# EAGLE design pov (EAGLE 6.2)
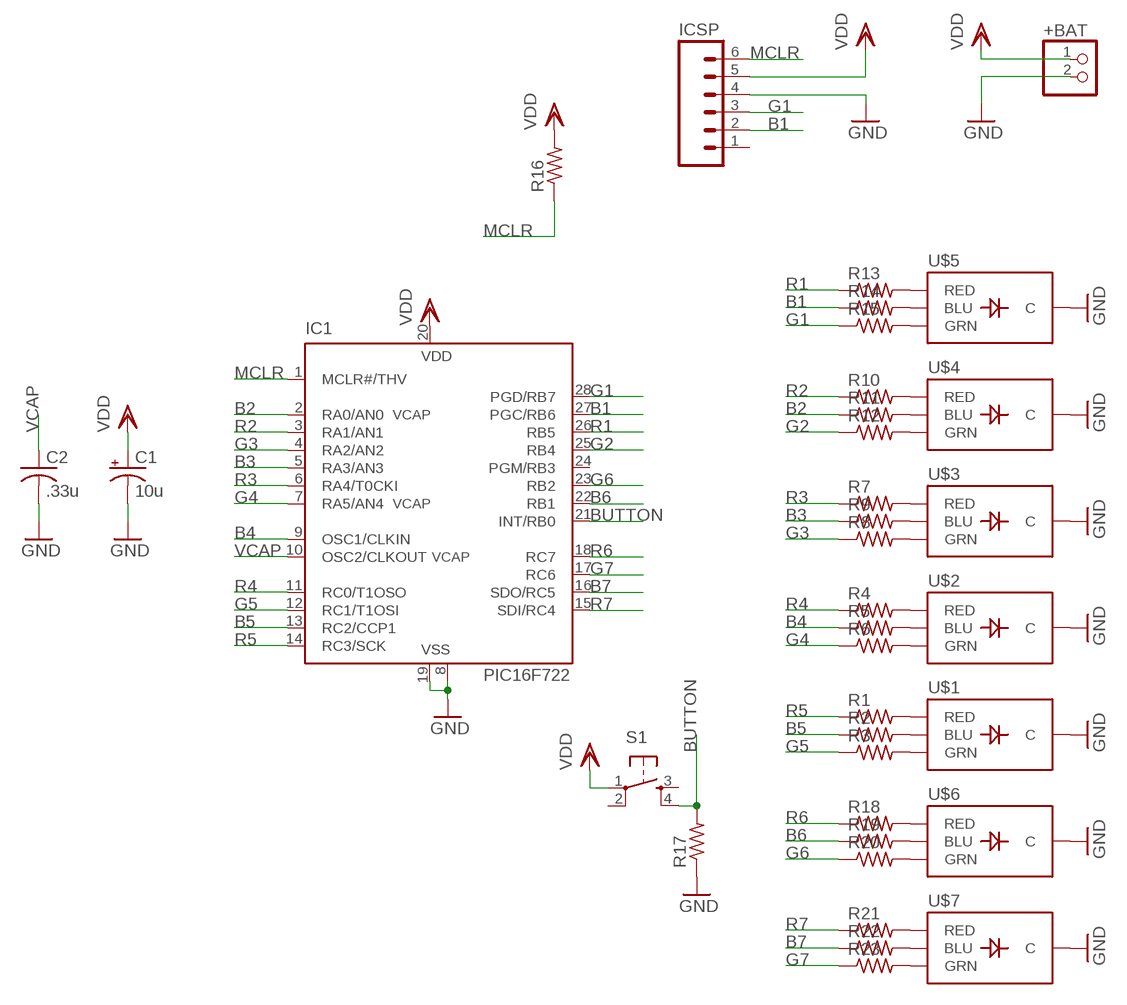
[diagram p0: schematic, sheet 1]

## Parts
+BAT  PINHD-1X2  [1X02]
C1  10u  CAP_POLPTH2  [CPOL-RADIAL-10UF-25V]
C2  .33u  C-US050-024X044  [C050-024X044]
IC1  PIC16F722  PIC16F872P  [DIL28-3]
ICSP  M06LOCK  [1X06_LOCK]
R1  R-US_0207/10  [0207/10]
R2  R-US_0207/10  [0207/10]
R3  R-US_0207/10  [0207/10]
R4  R-US_0207/10  [0207/10]
R5  R-US_0207/10  [0207/10]
R6  R-US_0207/10  [0207/10]
R7  R-US_0207/10  [0207/10]
R8  R-US_0207/10  [0207/10]
R9  R-US_0207/10  [0207/10]
R10  R-US_0207/10  [0207/10]
R11  R-US_0207/10  [0207/10]
R12  R-US_0207/10  [0207/10]
R13  R-US_0207/10  [0207/10]
R14  R-US_0207/10  [0207/10]
R15  R-US_0207/10  [0207/10]
R16  R-US_0207/10  [0207/10]
R17  R-US_0207/10  [0207/10]
R18  R-US_0207/10  [0207/10]
R19  R-US_0207/10  [0207/10]
R20  R-US_0207/10  [0207/10]
R21  R-US_0207/10  [0207/10]
R22  R-US_0207/10  [0207/10]
R23  R-US_0207/10  [0207/10]
S1  TAC_SWITCHPTH  [TACTILE-PTH]
U$1  LED-TRICOLOR-THROUGHHOLE  [LED-TRICOLOR-THROUGHHOLE]
U$2  LED-TRICOLOR-THROUGHHOLE  [LED-TRICOLOR-THROUGHHOLE]
U$3  LED-TRICOLOR-THROUGHHOLE  [LED-TRICOLOR-THROUGHHOLE]
U$4  LED-TRICOLOR-THROUGHHOLE  [LED-TRICOLOR-THROUGHHOLE]
U$5  LED-TRICOLOR-THROUGHHOLE  [LED-TRICOLOR-THROUGHHOLE]
U$6  LED-TRICOLOR-THROUGHHOLE  [LED-TRICOLOR-THROUGHHOLE]
U$7  LED-TRICOLOR-THROUGHHOLE  [LED-TRICOLOR-THROUGHHOLE]

## Nets
B1: IC1.27(PGC/RB6) ICSP.2 R14.1
B2: IC1.2(RA0/AN0) R11.1
B3: IC1.5(RA3/AN3) R9.1
B4: IC1.9(OSC1/CLKIN) R5.1
B5: IC1.13(RC2/CCP1) R2.1
B6: IC1.22(RB1) R19.1
B7: IC1.16(SDO/RC5) R22.1
BUTTON: IC1.21(INT/RB0) R17.2 S1.4
G1: IC1.28(PGD/RB7) ICSP.3 R15.1
G2: IC1.25(RB4) R12.1
G3: IC1.4(RA2/AN2) R8.1
G4: IC1.7(RA5/AN4) R6.1
G5: IC1.12(RC1/T1OSI) R3.1
G6: IC1.23(RB2) R20.1
G7: IC1.17(RC6) R23.1
GND: +BAT.2 C1.2(-) C2.2 IC1.8(VSS) IC1.19(VSS) ICSP.4 R17.1 U$1.GND(C) U$2.GND(C) U$3.GND(C) U$4.GND(C) U$5.GND(C) U$6.GND(C) U$7.GND(C)
MCLR: IC1.1(MCLR#/THV) ICSP.6 R16.1
N$1: R1.2 U$1.RED
N$2: R2.2 U$1.BLU
N$3: R3.2 U$1.GRN
N$4: R4.2 U$2.RED
N$5: R5.2 U$2.BLU
N$6: R6.2 U$2.GRN
N$7: R7.2 U$3.RED
N$8: R9.2 U$3.BLU
N$9: R10.2 U$4.RED
N$10: R11.2 U$4.BLU
N$11: R12.2 U$4.GRN
N$12: R13.2 U$5.RED
N$13: R14.2 U$5.BLU
N$14: R15.2 U$5.GRN
N$15: R8.2 U$3.GRN
N$17: R18.2 U$6.RED
N$18: R19.2 U$6.BLU
N$19: R20.2 U$6.GRN
N$20: R21.2 U$7.RED
N$21: R22.2 U$7.BLU
N$22: R23.2 U$7.GRN
R1: IC1.26(RB5) R13.1
R2: IC1.3(RA1/AN1) R10.1
R3: IC1.6(RA4/T0CKI) R7.1
R4: IC1.11(RC0/T1OSO) R4.1
R5: IC1.14(RC3/SCK) R1.1
R6: IC1.18(RC7) R18.1
R7: IC1.15(SDI/RC4) R21.1
VCAP: C2.1 IC1.10(OSC2/CLKOUT)
VDD: +BAT.1 C1.1(+) IC1.20(VDD) ICSP.5 R16.2 S1.1
Unconnected: IC1.24(PGM/RB3) ICSP.1 S1.2 S1.3

## Notes on the sheet
- VCAP
- VCAP
- VCAP

## Library data of the parts
+BAT = pinhead:PINHD-1X2: PIN HEADER
C1 = SparkFun:CAP_POL: Capacitor Polarized These are standard SMD and PTH capacitors. Normally 10uF, 47uF, and 100uF in electrolytic and tantalum varieties. Always verify the external diameter of the through hole cap, it varies with capacity, voltage, and manufacturer. The EIA devices should be standard.
C2 = rcl:C-US: CAPACITOR, American symbol
IC1 = microchip-5:PIC16*872: MICROCONTROLLER flash type
ICSP = SparkFun:M06: Header 6 Standard 6-pin 0.1" header. Use with straight break away headers (SKU : PRT-00116), right angle break away headers (PRT-00553), swiss pins (PRT-00743), machine pins (PRT-00117), and female headers (PRT-00115). Molex polarized connector foot print use with SKU : PRT-08094 with associated crimp pins and housings. NOTES ON THE VARIANTS LOCK and LOCK_LONGPADS... This footprint was designed to help hold the alignment of a through-hole component (i.e. 6-pin header) while soldering it into place. You may notice that each hole has been shifted either up or down by 0.005 of an inch from it's more standard position (which is a perfectly straight line). This slight alteration caused the pins (the squares in the middle) to touch the edges of the holes. Because they are alternating, it causes a "brace" to hold the component in place. 0.005 has proven to be the perfect amount of "off-center" position when using our standard breakaway headers. Although looks a little odd when you look at the bare footprint, once you have a header in there, the alteration is very hard to notice. Also, if you push a header all the way into place, it is covered up entirely on the bottom side. This idea of altering the position of holes to aid alignment will be further integrated into the Sparkfun Library for other footprints. It can help hold any component with 3 or more connection pins.
R1-R23 = rcl:R-US_: RESISTOR, American symbol
S1 = SparkFun:TAC_SWITCH: Momentary Switch Button commonly used for reset or general input. Spark Fun Electronics SKU : COM-00097
U$1-U$7 = SparkFun:LED-TRICOLOR-THROUGHHOLE

## Board
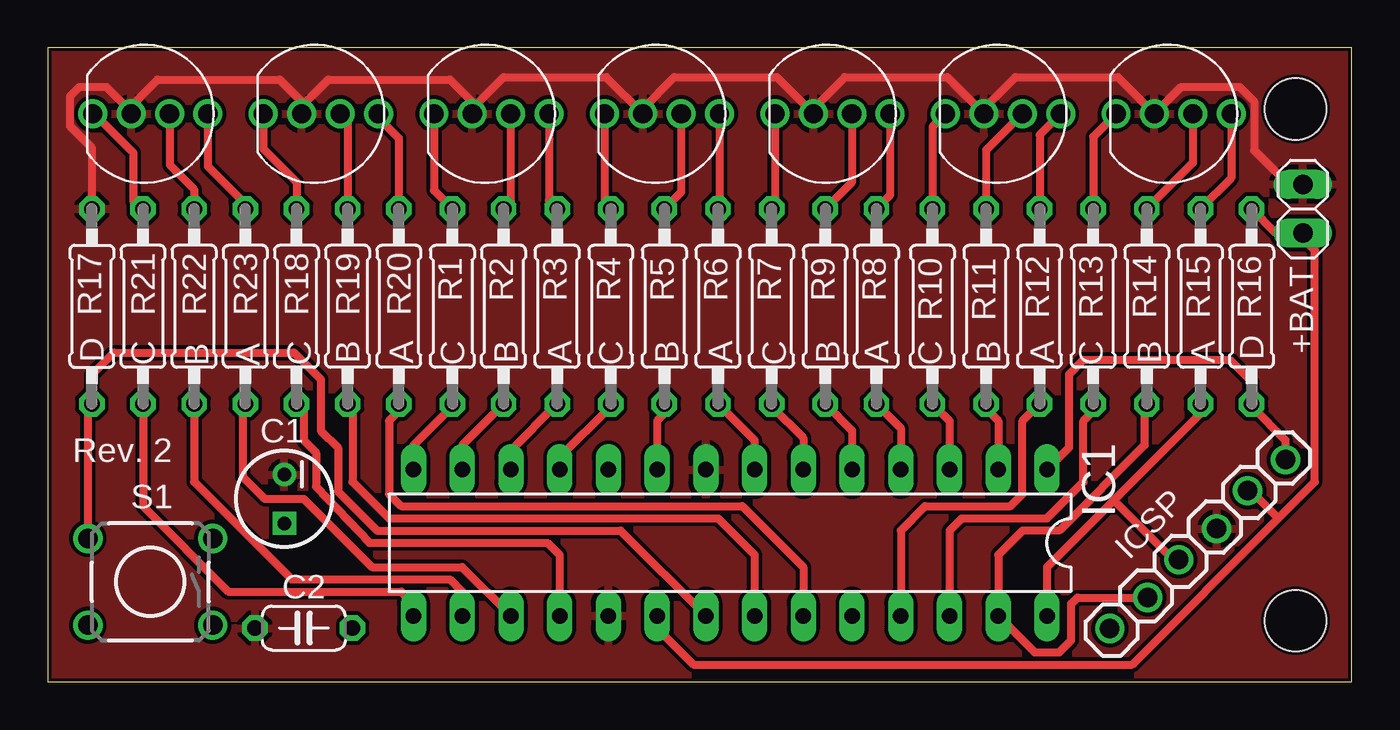
[diagram p1: board, top side]
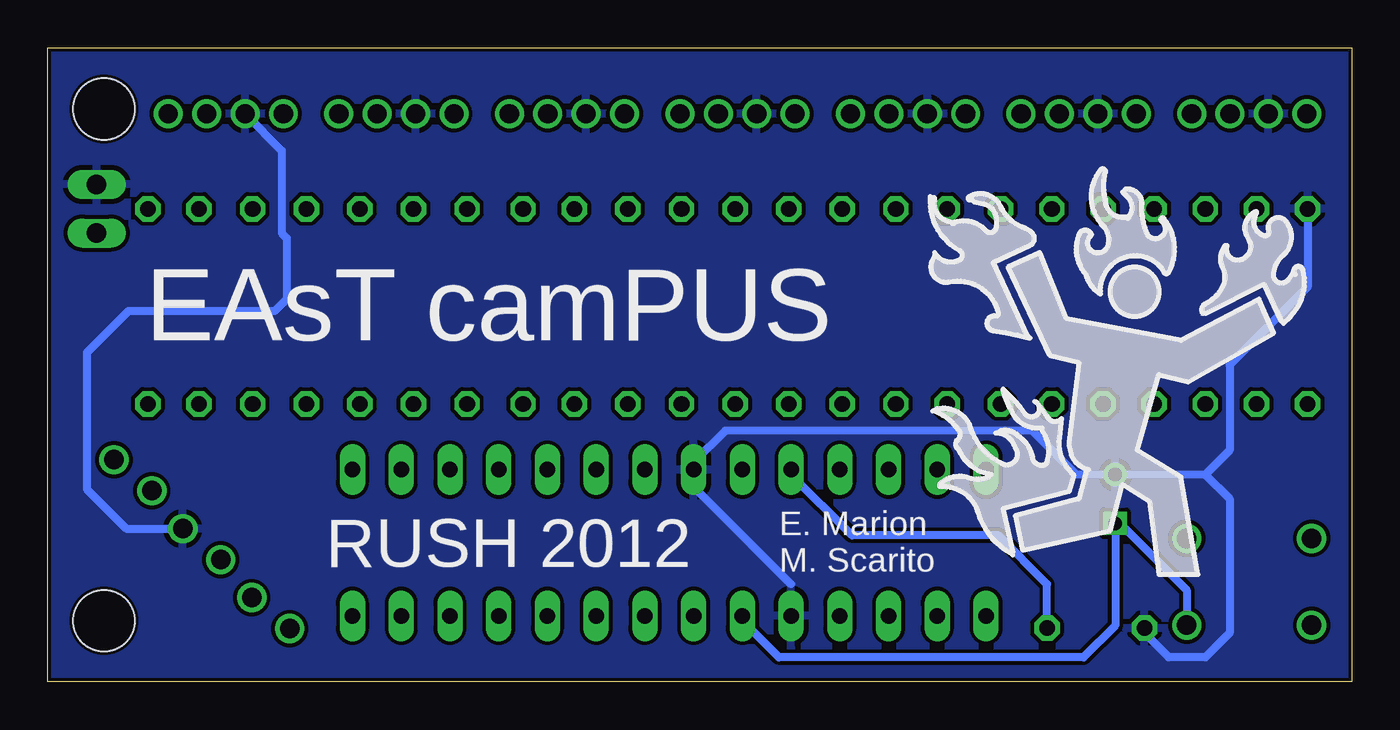
[diagram p2: board, bottom side, seen from below]

Size 67.95 x 33.02 mm. Coordinates in mm from the lower left corner, seen from the top.
Outline: 0,33.02 0,0 67.95,0 67.95,33.02 0,33.02
Copper layers (1*16): Top 0.035mm / dielectric 1.5mm / Bottom 0.035mm
Design rules: minimum track width 10mil, minimum drill 15mil, track to track 8mil, track to pad 8mil, pad to pad 8mil, via to via 8mil, smd to smd 8mil, copper to edge 7mil, drill to drill 8mil, minimum pad ring 10mil, minimum via ring 8mil, stop-mask expansion 4mil, vias tented up to drill 0mil, thermal gap 10mil
Holes 3.2 mm at 65.02,29.85 65.02,3.17

### Footprints (pad centres in the part's own frame; a part is rotated, then mirrored left to right if it is on the bottom)
1X02 = drill 1.016 long: 1 -1.27,0; 2 1.27,0
CPOL-RADIAL-10UF-25V = drill 0.7 square: 1 1.27,0 | drill 0.7: 2 -1.27,0
C050-024X044 = drill 0.813 octagon: 1 -2.54,0; 2 2.54,0
DIL28-3 = drill 0.813 long: 1 -16.51,-3.81; 2 -13.97,-3.81; 3 -11.43,-3.81; 4 -8.89,-3.81; 5 -6.35,-3.81; 6 -3.81,-3.81; 7 -1.27,-3.81; 8 1.27,-3.81; 9 3.81,-3.81; 10 6.35,-3.81; 11 8.89,-3.81; 12 11.43,-3.81; 13 13.97,-3.81; 14 16.51,-3.81; 15 16.51,3.81; 16 13.97,3.81; 17 11.43,3.81; 18 8.89,3.81; 19 6.35,3.81; 20 3.81,3.81; 21 1.27,3.81; 22 -1.27,3.81; 23 -3.81,3.81; 24 -6.35,3.81; 25 -8.89,3.81; 26 -11.43,3.81; 27 -13.97,3.81; 28 -16.51,3.81
1X06_LOCK = drill 1.016: 1 0,0; 2 2.54,-0.254; 3 5.08,0; 4 7.62,-0.254; 5 10.16,0; 6 12.7,-0.254
0207/10 = drill 0.813 octagon: 1 -5.08,0; 2 5.08,0
TACTILE-PTH = drill 1.016: 1 -3.251,2.261; 2 3.251,2.261; 3 -3.251,-2.261; 4 3.251,-2.261
LED-TRICOLOR-THROUGHHOLE = drill 1: BLU 1,0; GND -1,0; GRN 3,0; RED -3,0

### Placement (x,y rotation side)
+BAT  65.41,24.64 90 top
C1  12.32,9.52 270 top
C2  13.34,2.79 180 top
IC1  35.56,7.24 180 top
ICSP  55.35,2.77 45 top
R1  21.08,19.56 90 top
R2  23.75,19.56 90 top
R3  26.54,19.56 90 top
R4  29.34,19.56 90 top
R5  32.13,19.56 90 top
R6  34.93,19.56 90 top
R7  37.72,19.56 90 top
R8  43.18,19.56 90 top
R9  40.51,19.56 90 top
R10  46.1,19.56 90 top
R11  48.9,19.56 90 top
R12  51.69,19.56 90 top
R13  54.48,19.56 90 top
R14  57.28,19.56 90 top
R15  60.07,19.56 90 top
R16  62.74,19.56 90 top
R17  2.29,19.56 270 top
R18  12.95,19.56 90 top
R19  15.62,19.56 90 top
R20  18.29,19.56 90 top
R21  4.95,19.56 90 top
R22  7.62,19.56 90 top
R23  10.29,19.56 90 top
S1  5.33,5.21 180 top
U$1  23.11,29.59 0 top
U$2  32,29.59 0 top
U$3  40.89,29.59 0 top
U$4  49.78,29.59 0 top
U$5  58.67,29.59 0 top
U$6  14.22,29.59 0 top
U$7  5.33,29.59 0 top
U$8  [DONLAN_2]  12.7,15.24 0 bottom

### Tracks (layer width: path | path; a pad name or v marks a point on that pad's centre or on a via)
B1
  Top 0.406: R14.1 57.28,14.35 57.15,14.22 57.15,12.32 52.71,7.87 50.8,7.87 49.53,6.6 IC1.27 51.44,1.52 52.71,1.52 53.34,2.16 53.34,4.06 53.66,4.38 ICSP.2
B2
  Top 0.406: R11.1 48.9,14.22 49.53,13.59 IC1.2
B3
  Top 0.406: IC1.5 41.91,13.08 R9.1
B4
  Top 0.406: 32,14.35 R5.1 32.39,14.22 31.75,13.59 IC1.9
B5
  Top 0.406: IC1.13 21.59,12.32 R2.1
B6
  Top 0.406: IC1.22 36.83,6.6 34.93,8.51 17.78,8.51 15.88,10.41 15.88,14.22 R19.1
B7
  Top 0.406: IC1.16 21.59,4.7 20.95,5.33 12.7,5.33 7.62,10.41 R22.1
BUTTON
  Top 0.406: S1.4 2.08,14.15 2.29,14.35 R17.2 2.29,16 3.43,17.14 12.83,17.14 14.22,15.75 14.22,13.08 15.11,12.19 15.11,9.91 17.14,7.87 29.85,7.87 IC1.21
G1
  Top 0.406: R15.1 60.33,14.22 55.56,9.46 | IC1.28 52.07,5.97 55.56,9.46 | ICSP.3 58.67,6.36 55.56,9.46
G2
  Top 0.406: IC1.25 44.45,7.87 45.72,9.14 50.17,9.14 50.8,9.78 50.8,13.59 R12.1
G3
  Top 0.406: IC1.4 44.45,13.21 R8.1
G4
  Top 0.406: IC1.7 36.83,12.57 R6.1
G5
  Top 0.406: IC1.12 24.13,12.06 R3.1
G6
  Top 0.406: IC1.23 39.37,5.97 36.2,9.14 18.41,9.14 17.78,9.78 17.78,13.59 18.41,14.22 18.29,14.35 R20.1
G7
  Top 0.406: R23.1 10.29,14.35 10.16,14.22 10.16,10.67 11.3,9.52 13.34,9.52 16.89,5.97 21.59,5.97 IC1.17
GND
  Top 0.406: +BAT.2 64.64,25.91 62.87,27.69 62.87,30.23 62.1,30.99 59.07,30.99 U$5.GND 55.77,31.5 50.42,31.5 48.78,29.86 U$4.GND 46.88,31.5 41.53,31.5 39.89,29.86 U$3.GND 37.99,31.5 32.64,31.5 31,29.86 U$2.GND 29.1,31.5 23.75,31.5 22.11,29.86 U$1.GND 22.11,29.57 22.22,29.46 22.22,30.1 20.95,31.37 14.61,31.37 13.22,29.99 | 13.22,29.99 U$6.GND | 13.22,29.99 13.22,30.21 12.07,31.37 5.72,31.37 4.45,30.1 4.45,29.46 4.33,29.57 U$7.GND 4.33,29.7 3.05,30.99 1.65,30.99 1.14,30.48 1.14,28.96 2.29,27.81 R17.1
  Bottom 0.406: 60.83,7.9 ICSP.4 63.86,7.98 65.91,10.03 65.91,17.14 63.75,19.3 56.13,19.3 55.5,19.94 55.5,23.11 55.75,23.37 55.75,27.67 U$5.GND | 29.21,5.08 34.29,10.16 IC1.8 34.29,11.43 32.64,13.08 16.64,13.08 14.35,10.79 C1.2 7.62,10.79 | 7.62,10.79 6.35,9.52 6.35,2.54 7.62,1.27 9.52,1.27 10.8,2.54 C2.2 | R17.1 2.29,20.57 6.35,16.51 6.35,12.06 7.62,10.79
  pour Top: 73.03,-6.99 73.03,37.47 -2.54,37.47 -2.54,-6.99
  pour Bottom: 73.03,37.47 73.03,-6.99 -2.54,-6.99 -2.54,37.47
MCLR
  Top 0.406: ICSP.6 64.51,12.58 62.74,14.35 R16.1 62.74,15.62 61.59,16.76 53.98,16.76 53.21,16 53.21,12.19 IC1.1
N$1
  Top 0.406: U$1.RED 20.11,25.61 R1.2
N$2
  Top 0.406: U$1.BLU 24.11,25 R2.2
N$3
  Top 0.406: U$1.GRN 26.11,25.07 R3.2
N$4
  Top 0.406: U$2.RED 29,24.97 R4.2
N$5
  Top 0.406: U$2.BLU 33,25.51 R5.2
N$6
  Top 0.406: U$2.GRN 35,24.72 R6.2
N$7
  Top 0.406: U$3.RED 37.89,24.81 R7.2
N$8
  Top 0.406: U$3.BLU 41.89,26.02 R9.2
N$9
  Top 0.406: R10.2 46.1,28.91 U$4.RED
N$10
  Top 0.406: R11.2 48.9,27.7 U$4.BLU
N$11
  Top 0.406: R12.2 51.69,28.5 U$4.GRN
N$12
  Top 0.406: R13.2 54.48,28.4 U$5.RED
N$13
  Top 0.406: U$5.BLU 59.67,27.04 R14.2
N$14
  Top 0.406: U$5.GRN 61.67,26.24 R15.2
N$15
  Top 0.406: U$3.GRN 43.89,25.35 R8.2
N$17
  Top 0.406: R18.2 12.95,26.04 11.22,27.76 U$6.RED
N$18
  Top 0.406: U$6.BLU 15.22,29.48 15.62,29.08 R19.2
N$19
  Top 0.406: U$6.GRN 17.22,29.54 17.14,29.46 18.29,28.32 R20.2
N$20
  Top 0.406: U$7.RED 2.41,29.59 4.45,27.56 4.45,25.02 4.95,24.51 | 4.95,24.51 5.08,24.38 | 4.95,24.51 R21.2
N$21
  Top 0.406: R22.2 7.62,25.65 6.35,26.92 6.35,29.46 6.33,29.48 U$7.BLU
N$22
  Top 0.406: R23.2 10.29,24.89 8.33,26.85 U$7.GRN
R1
  Top 0.406: IC1.26 46.99,7.87 47.62,8.51 52.07,8.51 53.98,10.41 53.98,13.59 54.61,14.22 54.48,14.35 R13.1
R2
  Top 0.406: IC1.3 46.99,13.59 R10.1
R3
  Top 0.406: R7.1 37.72,14.35 39.37,12.7 IC1.6
R4
  Top 0.406: 29.46,14.35 R4.1 29.34,14.35 26.67,11.68 IC1.11
R5
  Top 0.406: R1.1 21.08,14.35 19.05,12.32 IC1.14
R6
  Top 0.406: IC1.18 26.67,6.6 26.04,7.24 16.76,7.24 13.97,10.16 13.97,11.94 13.34,12.57 13.34,14.22 13.08,14.48 R18.1
R7
  Top 0.406: IC1.15 19.05,4.06 18.41,4.7 9.4,4.7 4.95,9.14 R21.1
VCAP
  Bottom 0.406: C2.1 15.88,5.08 18.41,7.62 26.04,7.62 29.21,10.79 IC1.10
VDD
  Top 0.406: R16.2 64.01,23.37 +BAT.1 65.41,23.11 66.04,22.48 66.04,10.41 64.14,8.51 | ICSP.5 62.69,9.95 64.14,8.51 | IC1.20 31.75,2.79 33.66,0.89 56.52,0.89 64.14,8.51
  Bottom 0.406: S1.1 8.59,4.77 12.07,8.25 C1.1 12.32,2.92 13.97,1.27 29.85,1.27 31.75,3.17 IC1.20

### Text on the board
tNames: C | B | A | C | B | A | C | B | B | A | C | B | A | C | B | A | C | B | A | C | B | A | D | D | Rev. 2
bNames: EAsT camPUS | E. Marion | RUSH 2012 | M. Scarito